# EasyEDA schematic SCH_HABSat2_schematic_2023-01-31.json
TITLE: HABSat2 Schematic; REV: 1.0; Date: 2022-11-17; Sheet: 1/1; Company: Cosmo PK
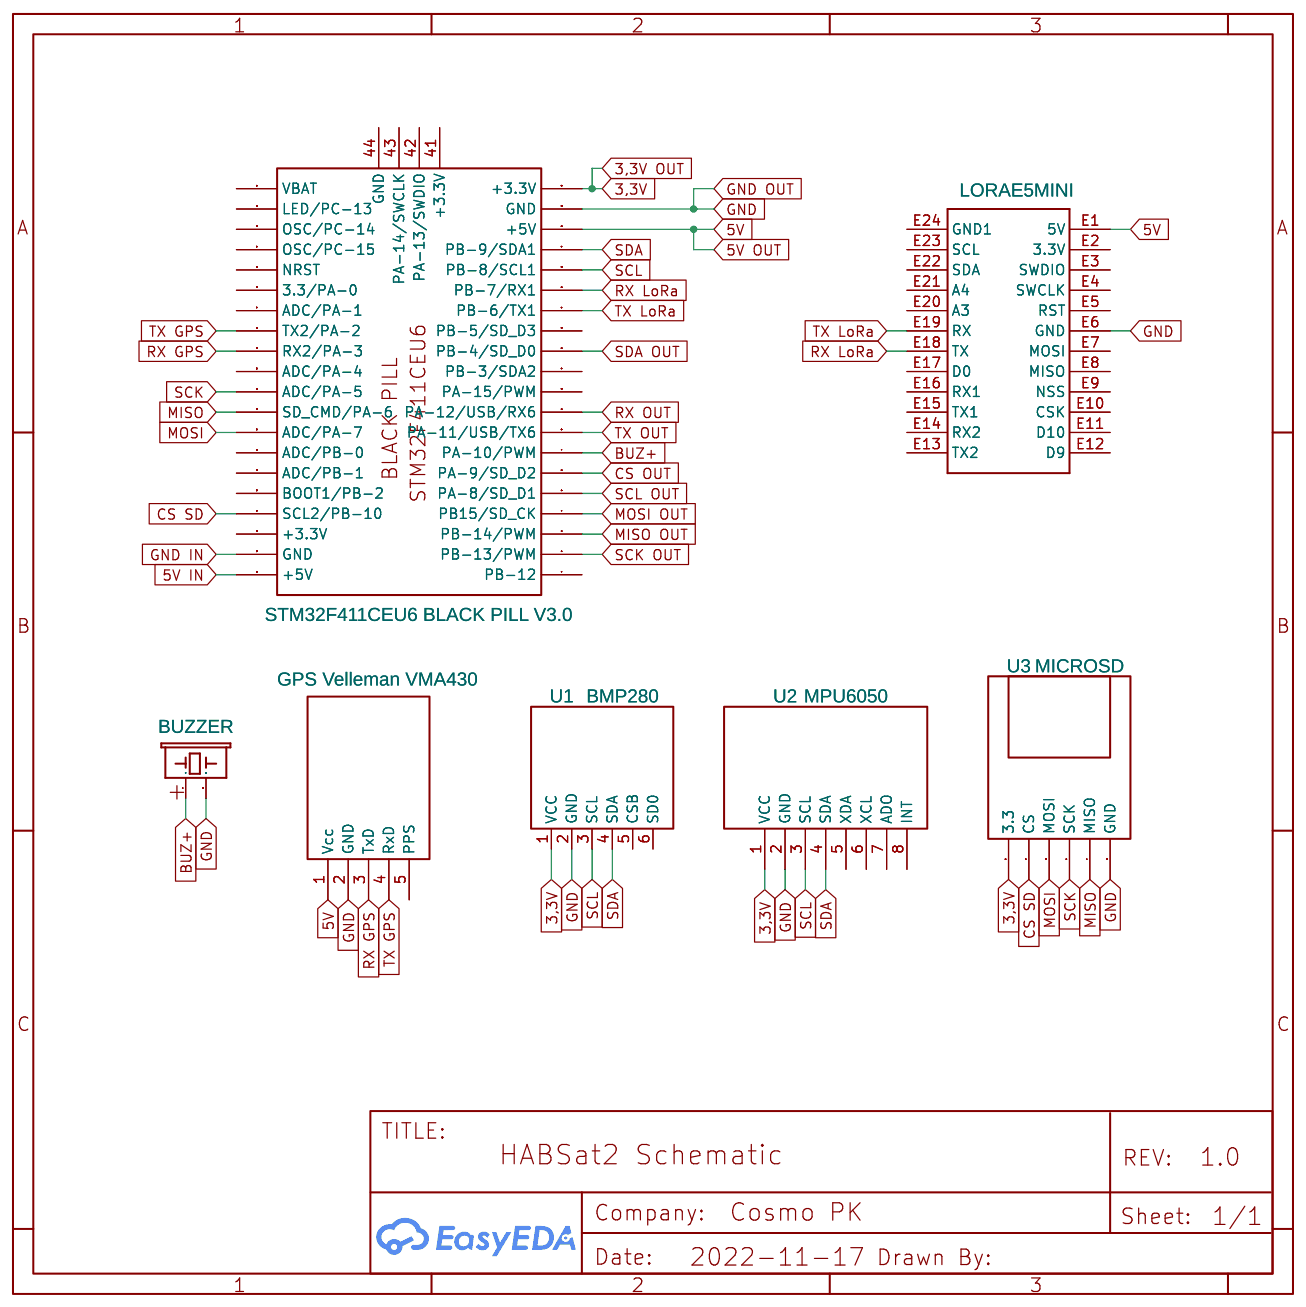
[diagram p0: schematic sheet]

## Parts
1  LORAE5MINI  [LORAE5MINI]
SG1  BUZZER  [BUZZER-KPX-120X]
STM1  STM32F411CEU6 BLACK PILL V3.0  [STM32F411CEU6BP]
U1  BMP280  [GY-BMP280]
U2  MPU6050  [MPU6050]
U3  MICROSD  [MICROSDCARDADAPTER]
VCC  GPS Velleman VMA430  [GPS VELLEMAN VMA430]

## Library data of the parts
1 = LORAE5MINI: Contributor: Niranjoy Y
SG1 = BUZZER KX-12MM: Contributor: SparkFun; sourceId: Q1xPJ1Vd7
STM1 = STM32F411CEU6 BLACK PILL V3.0: Contributor: sulthon100399
U1 = GY-BMP280: Contributor: umitmehmet2000
U2 = MPU6050: Contributor: Bas Stoker
U3 = MICROSD: Contributor: appurva
VCC = GPS Velleman VMA430: Manufacturer: Velleman; Manufacturer Part: VMA430; Supplier: botland; Supplier Part: VMA430; link: https://botland.com.pl/moduly-gps/13032-velleman-vma430-modul-gps-glonass-u-blox-neo-7m-uart-z-antena-5410329680930.html; Contributor: szczuplak

## Nets
5V: 1.E1(5V) STM1.18(+5V) VCC.1(Vcc)
5V IN: STM1.40(+5V)
GND: 1.E6(GND) SG1.2 STM1.19(GND) U1.2(GND) U2.2(GND) U3.6(GND) VCC.2(GND)
GND IN: STM1.39(GND)
3,3V: STM1.20(+3.3V) U1.1(VCC) U2.1(VCC) U3.5(3.3)
BUZ+: SG1.1 STM1.7(PA-10/PWM)
CS OUT: STM1.6(PA-9/SD_D2)
CS SD: STM1.37(SCL2/PB-10) U3.1(CS)
MISO: STM1.32(SD_CMD/PA-6) U3.4(MISO)
MISO OUT: STM1.3(PB-14/PWM)
MOSI: STM1.33(ADC/PA-7) U3.3(MOSI)
MOSI OUT: STM1.4(PB15/SD_CK)
RX GPS: STM1.29(RX2/PA-3) VCC.3(TxD)
RX LoRa: 1.E18(TX) STM1.15(PB-7/RX1)
RX OUT: STM1.9(PA-12/USB/RX6)
SCK: STM1.31(ADC/PA-5) U3.2(SCK)
SCK OUT: STM1.2(PB-13/PWM)
SCL: STM1.16(PB-8/SCL1) U1.3(SCL) U2.3(SCL)
SCL OUT: STM1.5(PA-8/SD_D1)
SDA: STM1.17(PB-9/SDA1) U1.4(SDA) U2.4(SDA)
SDA OUT: STM1.12(PB-4/SD_D0)
TX GPS: STM1.28(TX2/PA-2) VCC.4(RxD)
TX LoRa: 1.E19(RX) STM1.14(PB-6/TX1)
TX OUT: STM1.8(PA-11/USB/TX6)

Not connected (* = marked no-connect by the designer): 1 E2(3.3V) E3(SWDIO) E4(SWCLK) E5(RST) E7(MOSI) E8(MISO) E9(NSS) E10(CSK) E11(D10) E12(D9) E13(TX2) E14(RX2) E15(TX1) E16(RX1) E17(D0) E20(A3) E21(A4) E22(SDA) E23(SCL) E24(GND1); STM1 1(PB-12) 10(PA-15/PWM) 11(PB-3/SDA2) 13(PB-5/SD_D3) 21(VBAT) 22(LED/PC-13) 23(OSC/PC-14) 24(OSC/PC-15) 25(NRST) 26(3.3/PA-0) 27(ADC/PA-1) 30(ADC/PA-4) 34(ADC/PB-0) 35(ADC/PB-1) 36(BOOT1/PB-2) 38(+3.3V) 41(+3.3V) 42(PA-13/SWDIO) 43(PA-14/SWCLK) 44(GND); U1 5(CSB) 6(SD0); U2 5(XDA) 6(XCL) 7(ADO) 8(INT); VCC 5(PPS)
